# Altium schematic sheet main_board gen 2.schdoc
size 500 x 394 mm
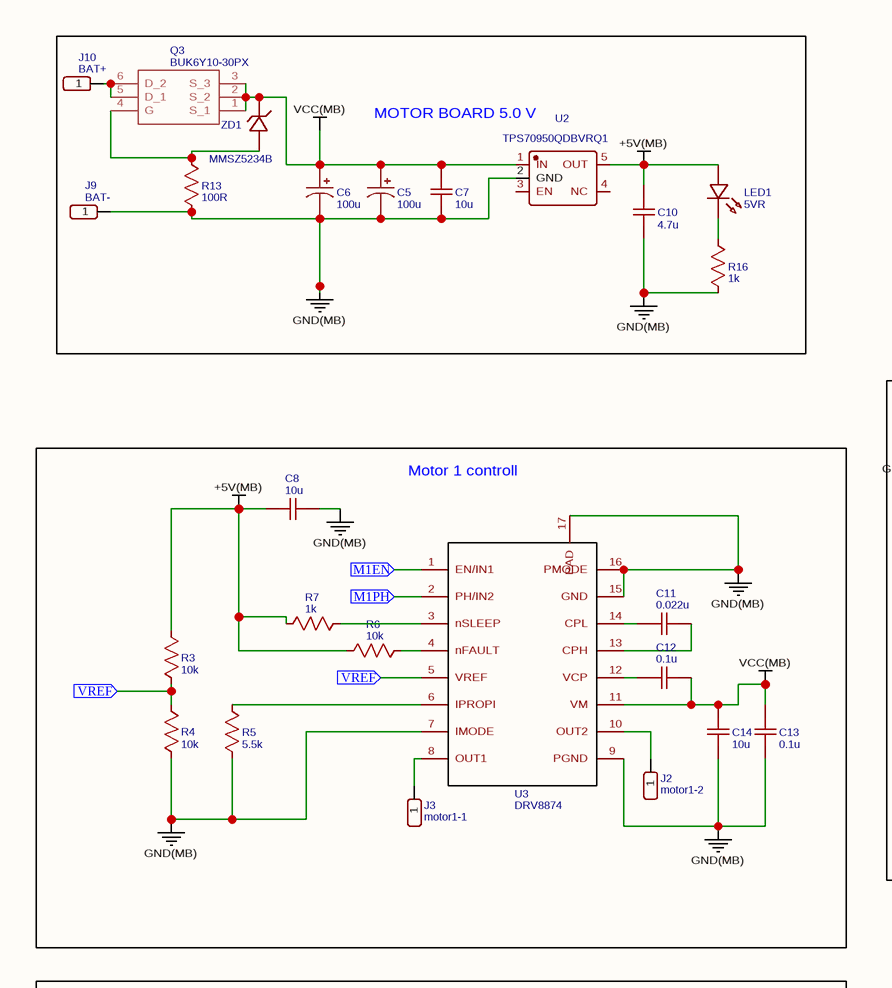
[diagram p0: main_board gen 2.schdoc, top left]
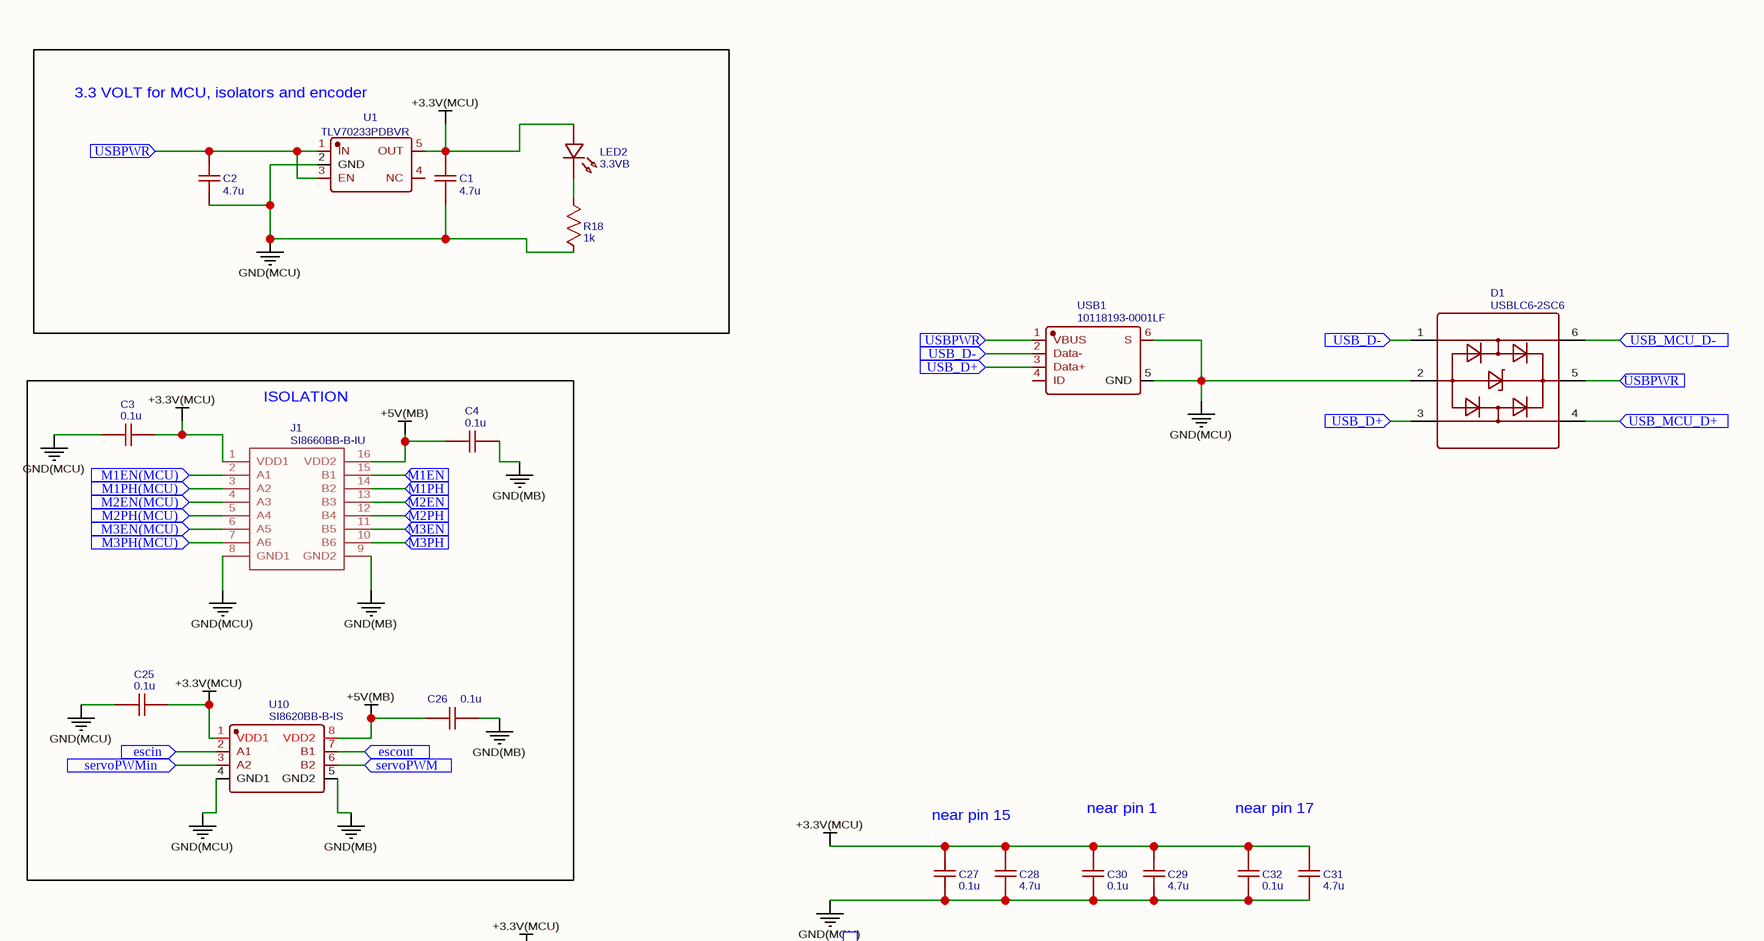
[diagram p1: main_board gen 2.schdoc, top right]
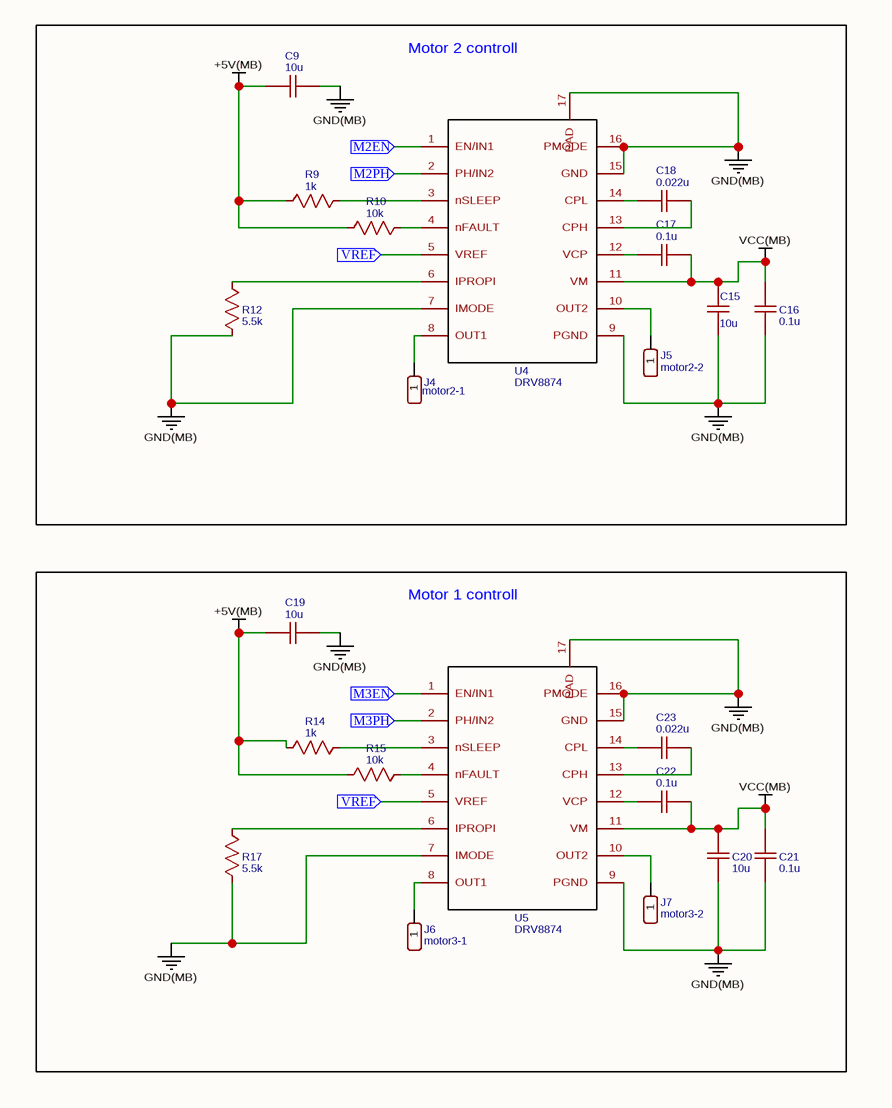
[diagram p2: main_board gen 2.schdoc, bottom left]
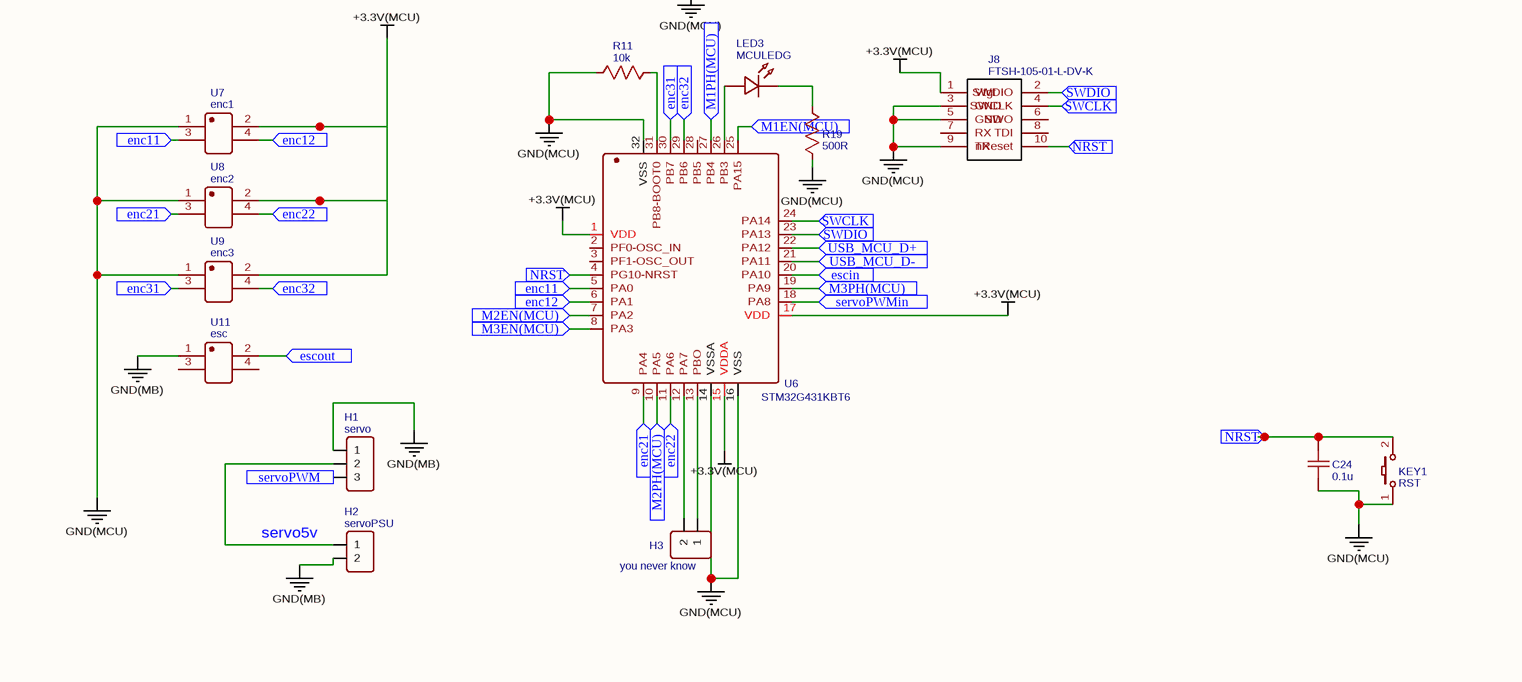
[diagram p3: main_board gen 2.schdoc, bottom right]

## Parts
C1  4.7u  [C1206]
C2  4.7u  [C1206]
C3  0.1u  [C0603]
C4  0.1u  [C0603]
C5  100u  [CAP-D6.3×F2.5]
C6  100u  [CAP-D6.3×F2.5]
C7  10u  [C1206]
C8  10u  [C1206]
C9  10u  [C1206]
C10  4.7u  [C1206]
C11  0.022u  [C0603]
C12  0.1u  [C0603]
C13  0.1u  [C0603]
C14  10u  [C1206]
C15  10u  [C1206]
C16  0.1u  [C0603]
C17  0.1u  [C0603]
C18  0.022u  [C0603]
C19  10u  [C1206]
C20  10u  [C1206]
C21  0.1u  [C0603]
C22  0.1u  [C0603]
C23  0.022u  [C0603]
C24  0.1u  [C0603]
C25  0.1u  [C0603]
C26  0.1u  [C0603]
C27  0.1u  [C0603]
C28  4.7u  [C1206]
C29  4.7u  [C1206]
C30  0.1u  [C0603]
C31  4.7u  [C1206]
C32  0.1u  [C1206]
D1  USBLC6-2SC6  [SOT-23-6_L2.9-W1.6-P0.95-LS2.8-BR]
H1  servo  [HDR-F-2.54_1X3]
H2  servoPSU  [HDR-F-2.54_1X2]
H3  you never know  [HDR-F-2.54_1X2]
J1  SI8660BB-B-IU  [SOP64P600X175-16N]
J2  motor1-2  [HDR-M-2.54_1X1]
J3  motor1-1  [HDR-M-2.54_1X1]
J4  motor2-1  [HDR-M-2.54_1X1]
J5  motor2-2  [HDR-M-2.54_1X1]
J6  motor3-1  [HDR-M-2.54_1X1]
J7  motor3-2  [HDR-M-2.54_1X1]
J8  FTSH-105-01-L-DV-K  [FTSH-105-01-L-DV-K]
J9  BAT-  [HDR-M-2.54_1X1]
J10  BAT+  [HDR-M-2.54_1X1]
KEY1  RST  [KEY-SMD_2P-L6.2-W3.6-LS8.0]
LED1  5VR  [LED0603_RED]
LED2  3.3VB  [LED0603_RED]
LED3  MCULEDG  [LED0603_RED]
Q3  BUK6Y10-30PX  [BUK6Y1030PX]
R3  10k  [R0603]
R4  10k  [R0603]
R5  5.5k  [R0603]
R6  10k  [R0603]
R7  1k  [R0603]
R9  1k  [R0603]
R10  10k  [R0603]
R11  10k  [R1206]
R12  5.5k  [R0603]
R13  100R  [R1206]
R14  1k  [R0603]
R15  10k  [R0603]
R16  1k  [R1206]
R17  5.5k  [R0603]
R18  1k  [R1206]
R19  500R  [R1206]
U1  TLV70233PDBVR  [SOT-23-5_L3.0-W1.7-P0.95-LS2.8-BL]
U2  TPS70950QDBVRQ1  [SOT-23-5_L3.0-W1.7-P0.95-LS2.8-BR]
U3  DRV8874  [DRV8874 FOOTPRINT]
U4  DRV8874  [DRV8874 FOOTPRINT]
U5  DRV8874  [DRV8874 FOOTPRINT]
U6  STM32G431KBT6  [LQFP-32_L7.0-W7.0-P0.80-LS9.0-BL]
U7  enc1  [CONN-TH_4P-P2.54-S2.54_L5.2-W7.1]
U8  enc2  [CONN-TH_4P-P2.54-S2.54_L5.2-W7.1]
U9  enc3  [CONN-TH_4P-P2.54-S2.54_L5.2-W7.1]
U10  SI8620BB-B-IS  [SOIC-8_L4.9-W3.9-P1.27-LS6.0-BL]
U11  esc  [CONN-TH_4P-P2.54-S2.54_L5.2-W7.1]
USB1  10118193-0001LF  [MICRO-USB-SMD_10118193-0001LF]
ZD1  MMSZ5234B  [SOD-123_L2.8-W1.8-LS3.7-RD]

## Blocks framed on the sheet
MOTOR BOARD 5.0 V: C5-C7 C10 J9 J10 LED1 Q3 R13 R16 U2 ZD1
3.3 VOLT for MCU, isolators and encoder: C1 C2 LED2 R18 U1
ISOLATION: C3 C4 C25 C26 J1 U10
Motor 1 controll: C8 C11-C14 J2 J3 R3-R7 U3
Motor 2 controll: C9 C15-C18 J4 J5 R9 R10 R12 U4
Motor 1 controll: C19-C23 J6 J7 R14 R15 R17 U5

## Ports
enc11 (in), enc12 (in), enc21 (in), enc22 (in), enc31 (in), enc32 (in), escin (in), escout (in), M1EN (in), M1EN(MCU) (in), M1PH (in), M1PH(MCU) (in), M2EN (in), M2EN(MCU) (in), M2PH (in), M2PH(MCU) (in), M3EN (in), M3EN(MCU) (in), M3PH (in), M3PH(MCU) (in), NRST (in), servoPWM (in), servoPWMin (in), SWCLK (in), SWDIO (in), USB_D+ (in), USB_D- (in), USB_MCU_D+ (in), USB_MCU_D- (in), USBPWR (in), VREF (in)

## Nets
+3.3V(MCU): C1.2 C3.1 C25.1 C27.2 C28.2 C29.2 C30.2 C31.2 C32.2 J1.1(VDD1) J8.1(Vtgt) LED2.1 U1.5(OUT) U6.1(VDD) U6.15(VDDA) U6.17(VDD) U7.2 U8.2 U9.2 U10.1(VDD1)
+5V(MB): C4.2 C8.1 C9.1 C10.2 C19.1 C26.2 J1.16(VDD2) LED1.1 R3.1 R6.1 R7.1 R9.1 R10.1 R14.1 R15.1 U2.5(OUT) U10.8(VDD2)
GND(MB): C4.1 C5.2 C6.2 C7.1 C8.2 C9.2 C10.1 C13.1 C14.1 C15.1 C16.1 C19.2 C20.1 C21.1 C26.1 H1.1 H2.2 J1.9(GND2) J9.1 R4.2 R5.1 R12.1 R13.1 R16.1 R17.1 U2.2(GND) U3.7(IMODE) U3.9(PGND) U3.15(GND) U3.16(PMODE) U3.17(PAD) U4.7(IMODE) U4.9(PGND) U4.15(GND) U4.16(PMODE) U4.17(PAD) U5.7(IMODE) U5.9(PGND) U5.15(GND) U5.16(PMODE) U5.17(PAD) U10.5(GND2) U11.1
GND(MCU): C1.1 C2.1 C3.2 C24.1 C25.2 C27.1 C28.1 C29.1 C30.1 C31.1 C32.1 D1.2 J1.8(GND1) J8.3(GND) J8.5(GND) J8.9(TX) KEY1.1 R11.1 R18.1 R19.1 U1.2(GND) U6.14(VSSA) U6.16(VSS) U6.32(VSS) U7.1 U8.1 U9.1 U10.4(GND1) USB1.5(GND) USB1.6(S)
VCC(MB): C5.1 C6.1 C7.2 C12.2 C13.2 C14.2 C15.2 C16.2 C17.2 C20.2 C21.2 C22.2 Q3.1(S_1) Q3.2(S_2) Q3.3(S_3) U2.1(IN) U3.11(VM) U4.11(VM) U5.11(VM) ZD1.1(K)
enc11: U6.5(PA0) U7.3 ; port enc11
enc12: U6.6(PA1) U7.4 ; port enc12
enc21: U6.9(PA4) U8.3 ; port enc21
enc22: U6.11(PA6) U8.4 ; port enc22
enc31: U6.30(PB7) U9.3 ; port enc31
enc32: U6.29(PB6) U9.4 ; port enc32
escin: U6.20(PA10) U10.2(A1) ; port escin
escout: U10.7(B1) U11.2 ; port escout
M1EN: J1.15(B1) U3.1(EN/IN1) ; port M1EN
M1EN(MCU): J1.2(A1) U6.25(PA15) ; port M1EN(MCU)
M1PH: J1.14(B2) U3.2(PH/IN2) ; port M1PH
M1PH(MCU): J1.3(A2) U6.27(PB4) ; port M1PH(MCU)
M2EN: J1.13(B3) U4.1(EN/IN1) ; port M2EN
M2EN(MCU): J1.4(A3) U6.7(PA2) ; port M2EN(MCU)
M2PH: J1.12(B4) U4.2(PH/IN2) ; port M2PH
M2PH(MCU): J1.5(A4) U6.10(PA5) ; port M2PH(MCU)
M3EN: J1.11(B5) U5.1(EN/IN1) ; port M3EN
M3EN(MCU): J1.6(A5) U6.8(PA3) ; port M3EN(MCU)
M3PH: J1.10(B6) U5.2(PH/IN2) ; port M3PH
M3PH(MCU): J1.7(A6) U6.19(PA9) ; port M3PH(MCU)
NRST: C24.2 J8.10(nReset) KEY1.2 U6.4(PG10-NRST) ; port NRST
servoPWM: H1.3 U10.6(B2) ; port servoPWM
servoPWMin: U6.18(PA8) U10.3(A2) ; port servoPWMin
SWCLK: J8.4(SWCLK) U6.24(PA14) ; port SWCLK
SWDIO: J8.2(SWDIO) U6.23(PA13) ; port SWDIO
USB_D+: D1.3 USB1.3(Data+) ; port USB_D+
USB_D-: D1.1 USB1.2(Data-) ; port USB_D-
USB_MCU_D+: D1.4 U6.22(PA12) ; port USB_MCU_D+
USB_MCU_D-: D1.6 U6.21(PA11) ; port USB_MCU_D-
USBPWR: C2.2 D1.5 U1.1(IN) U1.3(EN) USB1.1(VBUS) ; port USBPWR
VREF: R3.2 R4.1 U3.5(VREF) U4.5(VREF) U5.5(VREF) ; port VREF
NetC11_1: C11.1 U3.14(CPL)
NetC11_2: C11.2 U3.13(CPH)
NetC12_1: C12.1 U3.12(VCP)
NetC17_1: C17.1 U4.12(VCP)
NetC18_1: C18.1 U4.14(CPL)
NetC18_2: C18.2 U4.13(CPH)
NetC22_1: C22.1 U5.12(VCP)
NetC23_1: C23.1 U5.14(CPL)
NetC23_2: C23.2 U5.13(CPH)
NetH1_2: H1.2 H2.1
NetH3_1: H3.1 U6.13(PBO)
NetH3_2: H3.2 U6.12(PA7)
NetJ2_1: J2.1 U3.10(OUT2)
NetJ3_1: J3.1 U3.8(OUT1)
NetJ4_1: J4.1 U4.8(OUT1)
NetJ5_1: J5.1 U4.10(OUT2)
NetJ6_1: J6.1 U5.8(OUT1)
NetJ7_1: J7.1 U5.10(OUT2)
NetJ10_1: J10.1 Q3.5(D_1) Q3.6(D_2)
NetLED1_2: LED1.2 R16.2
NetLED2_2: LED2.2 R18.2
NetLED3_1: LED3.1 U6.26(PB3)
NetLED3_2: LED3.2 R19.2
NetQ3_4: Q3.4(G) R13.2 ZD1.2(A)
NetR5_2: R5.2 U3.6(IPROPI)
NetR6_2: R6.2 U3.4(nFAULT)
NetR7_2: R7.2 U3.3(nSLEEP)
NetR9_2: R9.2 U4.3(nSLEEP)
NetR10_2: R10.2 U4.4(nFAULT)
NetR11_2: R11.2 U6.31(PB8-BOOT0)
NetR12_2: R12.2 U4.6(IPROPI)
NetR14_2: R14.2 U5.3(nSLEEP)
NetR15_2: R15.2 U5.4(nFAULT)
NetR17_2: R17.2 U5.6(IPROPI)

Not connected (* = marked no-connect by the designer): J8 6(SWO) 7(RX) 8(TDI); U1 4(NC); U2 3(EN) 4(NC); U6 2(PF0-OSC_IN) 3(PF1-OSC_OUT) 28(PB5); U11 3 4; USB1 4(ID)

## Notes on the sheet
- near pin 15
- near pin 1
- near pin 17
- (near H2) servo5v

## Library data of the parts
C1 C2 C10 C28 C29 C31 = 4.7u: nameAlias: Value(F); Contributor: LCEDA_Lib; spicePre: C; spiceSymbolName: C_1206_US
C3 C25 = 0.1u: nameAlias: Value(F); Contributor: LCEDA_Lib; Package Display: No; spicePre: C; spiceSymbolName: C_1206_US
C4 C12 C13 C16 C17 C21 C22 C24 C26 C27 C30 C32 = 0.1u: nameAlias: Value(F); Contributor: LCEDA_Lib; spicePre: C; spiceSymbolName: C_1206_US
C5 C6 = 100u: nameAlias: Value(F); Contributor: LCEDA_Lib; spicePre: C; spiceSymbolName: CE_TH_D6.3×F2.5_US
C7-C9 C14 C15 C19 C20 = 10u: nameAlias: Value(F); Contributor: LCEDA_Lib; spicePre: C; spiceSymbolName: C_1206_US
C11 C18 C23 = 0.022u: nameAlias: Value(F); Contributor: LCEDA_Lib; spicePre: C; spiceSymbolName: C_1206_US
D1 = USBLC6-2SC6: BOM_Manufacturer: STMicroelectronics; SMT Type: Extend; BOM_Supplier: LCSC; BOM_Manufacturer Part: USBLC6-2SC6; image: //image.lceda.cn/szlcsc/C7519.jpg; BOM_Supplier Part: C7519; BOM_LCSC Assembly: Yes; spicePre: D; spiceSymbolName: USBLC6-2SC6
H1 = servo: Contributor: LCEDA_Lib; BOM_Supplier Part: C146690; BOM_Supplier: LCSC; spicePre: H; spiceSymbolName: HDR-F-2.54_1x3
H2 = servoPSU: Contributor: LCEDA_Lib; BOM_Supplier Part: C49661; BOM_Supplier: LCSC; spicePre: H; spiceSymbolName: HDR-F-2.54_1x2
H3 = you never know: Contributor: LCEDA_Lib; BOM_Supplier Part: C49661; BOM_Supplier: LCSC; spicePre: H; spiceSymbolName: HDR-F-2.54_1x2
J1 = SI8660BB-B-IU: Contributor: david rizhinashvili; spicePre: J; spiceSymbolName: SI8660BB-B-IU
J2 = motor1-2: Contributor: LCEDA_Lib; BOM_Supplier Part: C81276; BOM_Supplier: LCSC; spicePre: J; spiceSymbolName: HDR-M-2.54_1x1
J3 = motor1-1: Contributor: LCEDA_Lib; BOM_Supplier Part: C81276; BOM_Supplier: LCSC; spicePre: J; spiceSymbolName: HDR-M-2.54_1x1
J4 = motor2-1: Contributor: LCEDA_Lib; BOM_Supplier Part: C81276; BOM_Supplier: LCSC; spicePre: J; spiceSymbolName: HDR-M-2.54_1x1
J5 = motor2-2: Contributor: LCEDA_Lib; BOM_Supplier Part: C81276; BOM_Supplier: LCSC; spicePre: J; spiceSymbolName: HDR-M-2.54_1x1
J6 = motor3-1: Contributor: LCEDA_Lib; BOM_Supplier Part: C81276; BOM_Supplier: LCSC; spicePre: J; spiceSymbolName: HDR-M-2.54_1x1
J7 = motor3-2: Contributor: LCEDA_Lib; BOM_Supplier Part: C81276; BOM_Supplier: LCSC; spicePre: J; spiceSymbolName: HDR-M-2.54_1x1
J8 = FTSH-105-01-L-DV-K: Contributor: OBC Gang; BOM_Manufacturer Part: FTSH-105-01-L-DV-K; BOM_Supplier Part: SAM8799-ND; BOM_Supplier: Mouser; link: http://www.digikey.com/product-detail/en/samtec-inc/FTSH-105-01-L-DV-K/SAM8799-ND/1875039; spicePre: J; spiceSymbolName: FTSH-105-01-L-DV-K
J9 = BAT-: Contributor: LCEDA_Lib; BOM_Supplier Part: C81276; BOM_Supplier: LCSC; spicePre: J; spiceSymbolName: HDR-M-2.54_1x1
J10 = BAT+: Contributor: LCEDA_Lib; BOM_Supplier Part: C81276; BOM_Supplier: LCSC; spicePre: J; spiceSymbolName: HDR-M-2.54_1x1
KEY1 = RST: BOM_Manufacturer Part: K2-1107ST-A4SW-06; Contributor: LCEDA_Lib; 制造商: 韩国韩荣; BOM_Supplier Part: C118141; BOM_Supplier: LCSC; spicePre: K; spiceSymbolName: K2-3.6×6.1_SMD
LED1 = 5VR: BOM_Manufacturer: EVERLIGHT(台湾亿光); BOM_Manufacturer Part: 19-217/R6C-AL1M2VY/3T; Contributor: LCEDA_01; BOM_Supplier Part: C72044; BOM_Supplier: LCSC; spicePre: L; spiceSymbolName: LED-0603_R
LED2 = 3.3VB: BOM_Manufacturer: EVERLIGHT(台湾亿光); BOM_Manufacturer Part: 19-217/R6C-AL1M2VY/3T; Contributor: LCEDA_01; BOM_Supplier Part: C72044; BOM_Supplier: LCSC; spicePre: L; spiceSymbolName: LED-0603_R
LED3 = MCULEDG: BOM_Manufacturer: EVERLIGHT(台湾亿光); BOM_Manufacturer Part: 19-217/R6C-AL1M2VY/3T; Contributor: LCEDA_01; BOM_Supplier Part: C72044; BOM_Supplier: LCSC; spicePre: L; spiceSymbolName: LED-0603_R
Q3 = BUK6Y10-30PX: Contributor: david rizhinashvili; spicePre: Q; spiceSymbolName: BUK6Y10-30PX
R3 R4 R6 R10 R11 R15 = 10k: nameAlias: Value(Ω); Contributor: LCEDA_Lib; spicePre: R
  R3 R4 R6 R10 R15: spiceSymbolName: R_0603_US
  R11: spiceSymbolName: R_1206_US
R5 R12 R17 = 5.5k: nameAlias: Value(Ω); Contributor: LCEDA_Lib; spicePre: R; spiceSymbolName: R_0603_US
R7 R9 R14 R16 R18 = 1k: nameAlias: Value(Ω); Contributor: LCEDA_Lib; spicePre: R
  R7 R9 R14: spiceSymbolName: R_0603_US
  R16 R18: spiceSymbolName: R_1206_US
R13 = 100R: nameAlias: Value(Ω); Contributor: LCEDA_Lib; spicePre: R; spiceSymbolName: R_1206_US
R19 = 500R: nameAlias: Value(Ω); Contributor: LCEDA_Lib; spicePre: R; spiceSymbolName: R_1206_US
U1 = TLV70233PDBVR: BOM_Manufacturer: TI; Contributor: LCSC; SMT Type: Extend; BOM_Supplier: LCSC; BOM_Manufacturer Part: TLV70233PDBVR; BOM_Supplier Part: C123134; BOM_LCSC Assembly: Yes; spicePre: U; spiceSymbolName: TLV70233PDBVR
U2 = TPS70950QDBVRQ1: BOM_Manufacturer: Texas Instruments; Contributor: LCSC; BOM_Supplier: LCSC; BOM_Supplier Part: C485909; BOM_Manufacturer Part: TPS70950QDBVRQ1; spicePre: U; spiceSymbolName: TPS70950QDBVRQ1
U3-U5 = DRV8874: BOM_Manufacturer: Texas Instruments; Contributor: Plexus; BOM_Manufacturer Part: DRV8874; BOM_Supplier: TI; BOM_Supplier Part: DRV8874; link: https://www.ti.com/product/DRV8874; spicePre: U; spiceSymbolName: DRV8874
U6 = STM32G431KBT6: BOM_Manufacturer: STMicroelectronics; Contributor: LCSC; BOM_Supplier: LCSC; BOM_Supplier Part: C529357; BOM_Manufacturer Part: STM32G431KBT6; spicePre: U; spiceSymbolName: STM32G431KBT6
U7 = enc1: BOM_Manufacturer: TE Connectivity; BOM_Manufacturer Part: 215079-4; Contributor: LCSC; BOM_Supplier: LCSC; BOM_Supplier Part: C306232; spicePre: U; spiceSymbolName: 215079-4
U8 = enc2: BOM_Manufacturer: TE Connectivity; BOM_Manufacturer Part: 215079-4; Contributor: LCSC; BOM_Supplier: LCSC; BOM_Supplier Part: C306232; spicePre: U; spiceSymbolName: 215079-4
U9 = enc3: BOM_Manufacturer: TE Connectivity; BOM_Manufacturer Part: 215079-4; Contributor: LCSC; BOM_Supplier: LCSC; BOM_Supplier Part: C306232; spicePre: U; spiceSymbolName: 215079-4
U10 = SI8620BB-B-IS: BOM_Manufacturer: SILICON LABS; Contributor: LCSC; BOM_Supplier: LCSC; BOM_Supplier Part: C430264; BOM_Manufacturer Part: SI8620BB-B-IS; spicePre: U; spiceSymbolName: SI8620BB-B-IS
U11 = esc: BOM_Manufacturer: TE Connectivity; BOM_Manufacturer Part: 215079-4; Contributor: LCSC; BOM_Supplier: LCSC; BOM_Supplier Part: C306232; spicePre: U; spiceSymbolName: 215079-4
USB1 = 10118193-0001LF: BOM_Manufacturer: Amphenol ICC; Contributor: LCSC; BOM_Supplier: LCSC; BOM_Supplier Part: C132562; BOM_Manufacturer Part: 10118193-0001LF; spicePre: U; spiceSymbolName: 10118193-0001LF
ZD1 = MMSZ5234B: BOM_Manufacturer: CJ; SMT Type: Extend; BOM_Supplier: LCSC; BOM_Manufacturer Part: MMSZ5234B; image: //image.lceda.cn/szlcsc/C21556.jpg; BOM_Supplier Part: C21556; BOM_LCSC Assembly: Yes; spicePre: Z; spiceSymbolName: MMSZ5234B